# EAGLE schematic LEDSubMatrixHighDensity (EAGLE 9.6.2)
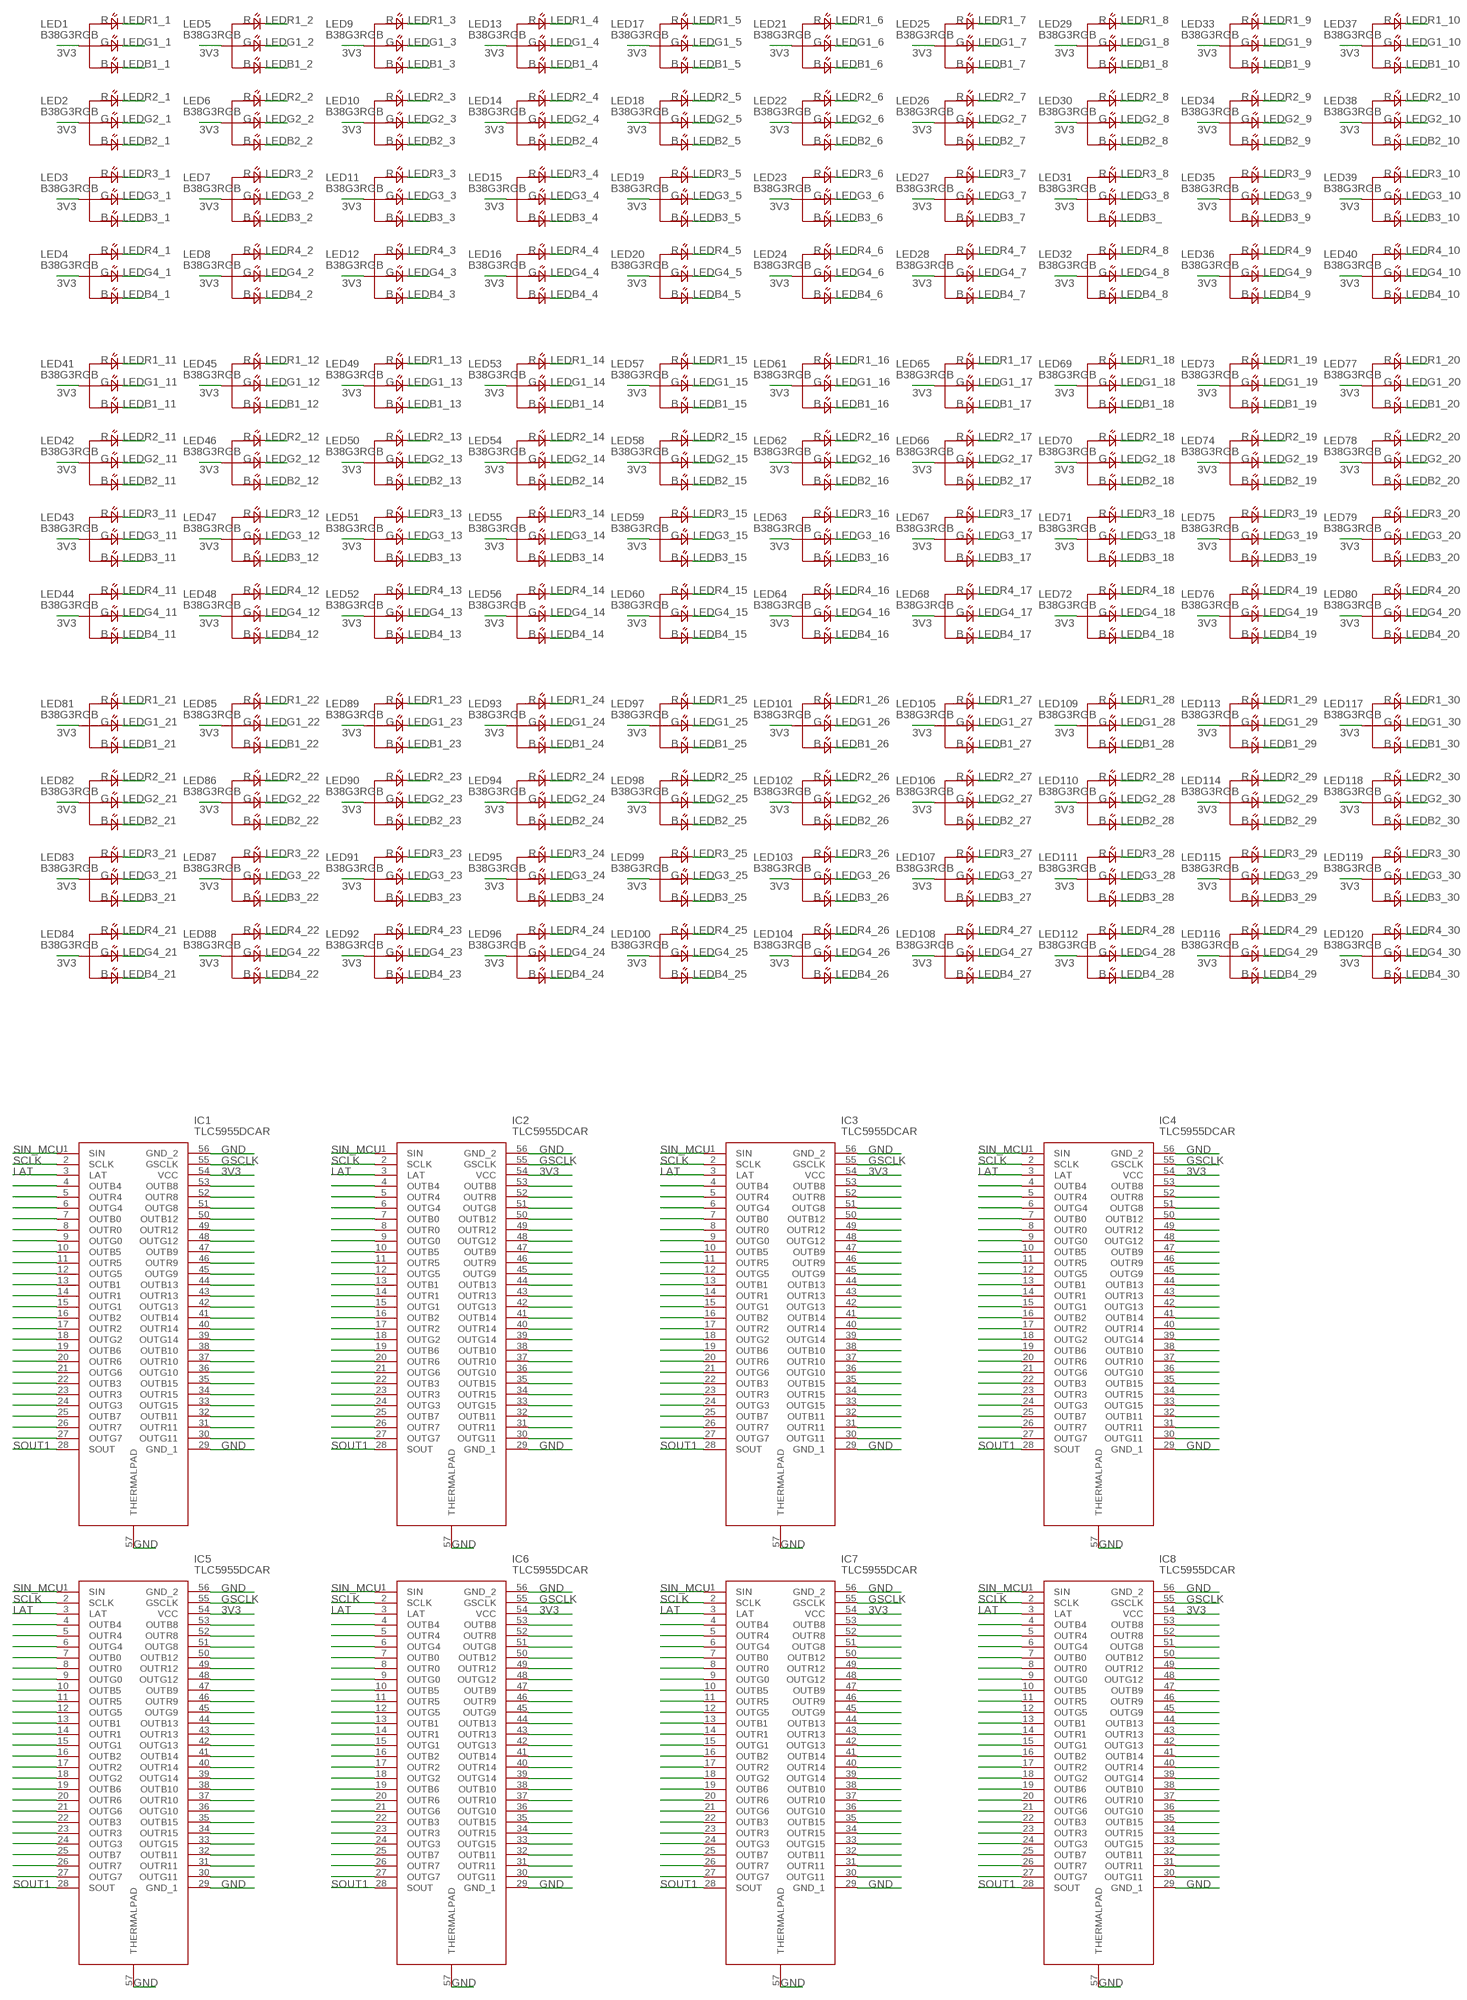
[diagram p0: schematic, sheet 1]

## Parts
IC1  TLC5955DCAR  [SOP50P810X120-57N]
IC2  TLC5955DCAR  [SOP50P810X120-57N]
IC3  TLC5955DCAR  [SOP50P810X120-57N]
IC4  TLC5955DCAR  [SOP50P810X120-57N]
IC5  TLC5955DCAR  [SOP50P810X120-57N]
IC6  TLC5955DCAR  [SOP50P810X120-57N]
IC7  TLC5955DCAR  [SOP50P810X120-57N]
IC8  TLC5955DCAR  [SOP50P810X120-57N]
LED1  B38G3RGB  [B38G3RGB]
LED2  B38G3RGB  [B38G3RGB]
LED3  B38G3RGB  [B38G3RGB]
LED4  B38G3RGB  [B38G3RGB]
LED5  B38G3RGB  [B38G3RGB]
LED6  B38G3RGB  [B38G3RGB]
LED7  B38G3RGB  [B38G3RGB]
LED8  B38G3RGB  [B38G3RGB]
LED9  B38G3RGB  [B38G3RGB]
LED10  B38G3RGB  [B38G3RGB]
LED11  B38G3RGB  [B38G3RGB]
LED12  B38G3RGB  [B38G3RGB]
LED13  B38G3RGB  [B38G3RGB]
LED14  B38G3RGB  [B38G3RGB]
LED15  B38G3RGB  [B38G3RGB]
LED16  B38G3RGB  [B38G3RGB]
LED17  B38G3RGB  [B38G3RGB]
LED18  B38G3RGB  [B38G3RGB]
LED19  B38G3RGB  [B38G3RGB]
LED20  B38G3RGB  [B38G3RGB]
LED21  B38G3RGB  [B38G3RGB]
LED22  B38G3RGB  [B38G3RGB]
LED23  B38G3RGB  [B38G3RGB]
LED24  B38G3RGB  [B38G3RGB]
LED25  B38G3RGB  [B38G3RGB]
LED26  B38G3RGB  [B38G3RGB]
LED27  B38G3RGB  [B38G3RGB]
LED28  B38G3RGB  [B38G3RGB]
LED29  B38G3RGB  [B38G3RGB]
LED30  B38G3RGB  [B38G3RGB]
LED31  B38G3RGB  [B38G3RGB]
LED32  B38G3RGB  [B38G3RGB]
LED33  B38G3RGB  [B38G3RGB]
LED34  B38G3RGB  [B38G3RGB]
LED35  B38G3RGB  [B38G3RGB]
LED36  B38G3RGB  [B38G3RGB]
LED37  B38G3RGB  [B38G3RGB]
LED38  B38G3RGB  [B38G3RGB]
LED39  B38G3RGB  [B38G3RGB]
LED40  B38G3RGB  [B38G3RGB]
LED41  B38G3RGB  [B38G3RGB]
LED42  B38G3RGB  [B38G3RGB]
LED43  B38G3RGB  [B38G3RGB]
LED44  B38G3RGB  [B38G3RGB]
LED45  B38G3RGB  [B38G3RGB]
LED46  B38G3RGB  [B38G3RGB]
LED47  B38G3RGB  [B38G3RGB]
LED48  B38G3RGB  [B38G3RGB]
LED49  B38G3RGB  [B38G3RGB]
LED50  B38G3RGB  [B38G3RGB]
LED51  B38G3RGB  [B38G3RGB]
LED52  B38G3RGB  [B38G3RGB]
LED53  B38G3RGB  [B38G3RGB]
LED54  B38G3RGB  [B38G3RGB]
LED55  B38G3RGB  [B38G3RGB]
LED56  B38G3RGB  [B38G3RGB]
LED57  B38G3RGB  [B38G3RGB]
LED58  B38G3RGB  [B38G3RGB]
LED59  B38G3RGB  [B38G3RGB]
LED60  B38G3RGB  [B38G3RGB]
LED61  B38G3RGB  [B38G3RGB]
LED62  B38G3RGB  [B38G3RGB]
LED63  B38G3RGB  [B38G3RGB]
LED64  B38G3RGB  [B38G3RGB]
LED65  B38G3RGB  [B38G3RGB]
LED66  B38G3RGB  [B38G3RGB]
LED67  B38G3RGB  [B38G3RGB]
LED68  B38G3RGB  [B38G3RGB]
LED69  B38G3RGB  [B38G3RGB]
LED70  B38G3RGB  [B38G3RGB]
LED71  B38G3RGB  [B38G3RGB]
LED72  B38G3RGB  [B38G3RGB]
LED73  B38G3RGB  [B38G3RGB]
LED74  B38G3RGB  [B38G3RGB]
LED75  B38G3RGB  [B38G3RGB]
LED76  B38G3RGB  [B38G3RGB]
LED77  B38G3RGB  [B38G3RGB]
LED78  B38G3RGB  [B38G3RGB]
LED79  B38G3RGB  [B38G3RGB]
LED80  B38G3RGB  [B38G3RGB]
LED81  B38G3RGB  [B38G3RGB]
LED82  B38G3RGB  [B38G3RGB]
LED83  B38G3RGB  [B38G3RGB]
LED84  B38G3RGB  [B38G3RGB]
LED85  B38G3RGB  [B38G3RGB]
LED86  B38G3RGB  [B38G3RGB]
LED87  B38G3RGB  [B38G3RGB]
LED88  B38G3RGB  [B38G3RGB]
LED89  B38G3RGB  [B38G3RGB]
LED90  B38G3RGB  [B38G3RGB]
LED91  B38G3RGB  [B38G3RGB]
LED92  B38G3RGB  [B38G3RGB]
LED93  B38G3RGB  [B38G3RGB]
LED94  B38G3RGB  [B38G3RGB]
LED95  B38G3RGB  [B38G3RGB]
LED96  B38G3RGB  [B38G3RGB]
LED97  B38G3RGB  [B38G3RGB]
LED98  B38G3RGB  [B38G3RGB]
LED99  B38G3RGB  [B38G3RGB]
LED100  B38G3RGB  [B38G3RGB]
LED101  B38G3RGB  [B38G3RGB]
LED102  B38G3RGB  [B38G3RGB]
LED103  B38G3RGB  [B38G3RGB]
LED104  B38G3RGB  [B38G3RGB]
LED105  B38G3RGB  [B38G3RGB]
LED106  B38G3RGB  [B38G3RGB]
LED107  B38G3RGB  [B38G3RGB]
LED108  B38G3RGB  [B38G3RGB]
LED109  B38G3RGB  [B38G3RGB]
LED110  B38G3RGB  [B38G3RGB]
LED111  B38G3RGB  [B38G3RGB]
LED112  B38G3RGB  [B38G3RGB]
LED113  B38G3RGB  [B38G3RGB]
LED114  B38G3RGB  [B38G3RGB]
LED115  B38G3RGB  [B38G3RGB]
LED116  B38G3RGB  [B38G3RGB]
LED117  B38G3RGB  [B38G3RGB]
LED118  B38G3RGB  [B38G3RGB]
LED119  B38G3RGB  [B38G3RGB]
LED120  B38G3RGB  [B38G3RGB]

## Nets
3V3: IC1.54(VCC) IC2.54(VCC) IC3.54(VCC) IC4.54(VCC) IC5.54(VCC) IC6.54(VCC) IC7.54(VCC) IC8.54(VCC) LED1.3(COM) LED2.3(COM) LED3.3(COM) LED4.3(COM) LED5.3(COM) LED6.3(COM) LED7.3(COM) LED8.3(COM) LED9.3(COM) LED10.3(COM) LED11.3(COM) LED12.3(COM) LED13.3(COM) LED14.3(COM) LED15.3(COM) LED16.3(COM) LED17.3(COM) LED18.3(COM) LED19.3(COM) LED20.3(COM) LED21.3(COM) LED22.3(COM) LED23.3(COM) LED24.3(COM) LED25.3(COM) LED26.3(COM) LED27.3(COM) LED28.3(COM) LED29.3(COM) LED30.3(COM) LED31.3(COM) LED32.3(COM) LED33.3(COM) LED34.3(COM) LED35.3(COM) LED36.3(COM) LED37.3(COM) LED38.3(COM) LED39.3(COM) LED40.3(COM) LED41.3(COM) LED42.3(COM) LED43.3(COM) LED44.3(COM) LED45.3(COM) LED46.3(COM) LED47.3(COM) LED48.3(COM) LED49.3(COM) LED50.3(COM) LED51.3(COM) LED52.3(COM) LED53.3(COM) LED54.3(COM) LED55.3(COM) LED56.3(COM) LED57.3(COM) LED58.3(COM) LED59.3(COM) LED60.3(COM) LED61.3(COM) LED62.3(COM) LED63.3(COM) LED64.3(COM) LED65.3(COM) LED66.3(COM) LED67.3(COM) LED68.3(COM) LED69.3(COM) LED70.3(COM) LED71.3(COM) LED72.3(COM) LED73.3(COM) LED74.3(COM) LED75.3(COM) LED76.3(COM) LED77.3(COM) LED78.3(COM) LED79.3(COM) LED80.3(COM) LED81.3(COM) LED82.3(COM) LED83.3(COM) LED84.3(COM) LED85.3(COM) LED86.3(COM) LED87.3(COM) LED88.3(COM) LED89.3(COM) LED90.3(COM) LED91.3(COM) LED92.3(COM) LED93.3(COM) LED94.3(COM) LED95.3(COM) LED96.3(COM) LED97.3(COM) LED98.3(COM) LED99.3(COM) LED100.3(COM) LED101.3(COM) LED102.3(COM) LED103.3(COM) LED104.3(COM) LED105.3(COM) LED106.3(COM) LED107.3(COM) LED108.3(COM) LED109.3(COM) LED110.3(COM) LED111.3(COM) LED112.3(COM) LED113.3(COM) LED114.3(COM) LED115.3(COM) LED116.3(COM) LED117.3(COM) LED118.3(COM) LED119.3(COM) LED120.3(COM)
GND: IC1.29(GND_1) IC1.56(GND_2) IC1.57(THERMALPAD) IC2.29(GND_1) IC2.56(GND_2) IC2.57(THERMALPAD) IC3.29(GND_1) IC3.56(GND_2) IC3.57(THERMALPAD) IC4.29(GND_1) IC4.56(GND_2) IC4.57(THERMALPAD) IC5.29(GND_1) IC5.56(GND_2) IC5.57(THERMALPAD) IC6.29(GND_1) IC6.56(GND_2) IC6.57(THERMALPAD) IC7.29(GND_1) IC7.56(GND_2) IC7.57(THERMALPAD) IC8.29(GND_1) IC8.56(GND_2) IC8.57(THERMALPAD)
GSCLK: IC1.55(GSCLK) IC2.55(GSCLK) IC3.55(GSCLK) IC4.55(GSCLK) IC5.55(GSCLK) IC6.55(GSCLK) IC7.55(GSCLK) IC8.55(GSCLK)
LAT: IC1.3(LAT) IC2.3(LAT) IC3.3(LAT) IC4.3(LAT) IC5.3(LAT) IC6.3(LAT) IC7.3(LAT) IC8.3(LAT)
LEDB1_1: LED1.2(BLUE)
LEDB1_2: LED5.2(BLUE)
LEDB1_3: LED9.2(BLUE)
LEDB1_4: LED13.2(BLUE)
LEDB1_5: LED17.2(BLUE)
LEDB1_6: LED21.2(BLUE)
LEDB1_7: LED25.2(BLUE)
LEDB1_8: LED29.2(BLUE)
LEDB1_9: LED33.2(BLUE)
LEDB1_10: LED37.2(BLUE)
LEDB1_11: LED41.2(BLUE)
LEDB1_12: LED45.2(BLUE)
LEDB1_13: LED49.2(BLUE)
LEDB1_14: LED53.2(BLUE)
LEDB1_15: LED57.2(BLUE)
LEDB1_16: LED61.2(BLUE)
LEDB1_17: LED65.2(BLUE)
LEDB1_18: LED69.2(BLUE)
LEDB1_19: LED73.2(BLUE)
LEDB1_20: LED77.2(BLUE)
LEDB1_21: LED81.2(BLUE)
LEDB1_22: LED85.2(BLUE)
LEDB1_23: LED89.2(BLUE)
LEDB1_24: LED93.2(BLUE)
LEDB1_25: LED97.2(BLUE)
LEDB1_26: LED101.2(BLUE)
LEDB1_27: LED105.2(BLUE)
LEDB1_28: LED109.2(BLUE)
LEDB1_29: LED113.2(BLUE)
LEDB1_30: LED117.2(BLUE)
LEDB2_1: LED2.2(BLUE)
LEDB2_2: LED6.2(BLUE)
LEDB2_3: LED10.2(BLUE)
LEDB2_4: LED14.2(BLUE)
LEDB2_5: LED18.2(BLUE)
LEDB2_6: LED22.2(BLUE)
LEDB2_7: LED26.2(BLUE)
LEDB2_8: LED30.2(BLUE)
LEDB2_9: LED34.2(BLUE)
LEDB2_10: LED38.2(BLUE)
LEDB2_11: LED42.2(BLUE)
LEDB2_12: LED46.2(BLUE)
LEDB2_13: LED50.2(BLUE)
LEDB2_14: LED54.2(BLUE)
LEDB2_15: LED58.2(BLUE)
LEDB2_16: LED62.2(BLUE)
LEDB2_17: LED66.2(BLUE)
LEDB2_18: LED70.2(BLUE)
LEDB2_19: LED74.2(BLUE)
LEDB2_20: LED78.2(BLUE)
LEDB2_21: LED82.2(BLUE)
LEDB2_22: LED86.2(BLUE)
LEDB2_23: LED90.2(BLUE)
LEDB2_24: LED94.2(BLUE)
LEDB2_25: LED98.2(BLUE)
LEDB2_26: LED102.2(BLUE)
LEDB2_27: LED106.2(BLUE)
LEDB2_28: LED110.2(BLUE)
LEDB2_29: LED114.2(BLUE)
LEDB2_30: LED118.2(BLUE)
LEDB3_: LED31.2(BLUE)
LEDB3_1: LED3.2(BLUE)
LEDB3_2: LED7.2(BLUE)
LEDB3_3: LED11.2(BLUE)
LEDB3_4: LED15.2(BLUE)
LEDB3_5: LED19.2(BLUE)
LEDB3_6: LED23.2(BLUE)
LEDB3_7: LED27.2(BLUE)
LEDB3_9: LED35.2(BLUE)
LEDB3_10: LED39.2(BLUE)
LEDB3_11: LED43.2(BLUE)
LEDB3_12: LED47.2(BLUE)
LEDB3_13: LED51.2(BLUE)
LEDB3_14: LED55.2(BLUE)
LEDB3_15: LED59.2(BLUE)
LEDB3_16: LED63.2(BLUE)
LEDB3_17: LED67.2(BLUE)
LEDB3_18: LED71.2(BLUE)
LEDB3_19: LED75.2(BLUE)
LEDB3_20: LED79.2(BLUE)
LEDB3_21: LED83.2(BLUE)
LEDB3_22: LED87.2(BLUE)
LEDB3_23: LED91.2(BLUE)
LEDB3_24: LED95.2(BLUE)
LEDB3_25: LED99.2(BLUE)
LEDB3_26: LED103.2(BLUE)
LEDB3_27: LED107.2(BLUE)
LEDB3_28: LED111.2(BLUE)
LEDB3_29: LED115.2(BLUE)
LEDB3_30: LED119.2(BLUE)
LEDB4_1: LED4.2(BLUE)
LEDB4_2: LED8.2(BLUE)
LEDB4_3: LED12.2(BLUE)
LEDB4_4: LED16.2(BLUE)
LEDB4_5: LED20.2(BLUE)
LEDB4_6: LED24.2(BLUE)
LEDB4_7: LED28.2(BLUE)
LEDB4_8: LED32.2(BLUE)
LEDB4_9: LED36.2(BLUE)
LEDB4_10: LED40.2(BLUE)
LEDB4_11: LED44.2(BLUE)
LEDB4_12: LED48.2(BLUE)
LEDB4_13: LED52.2(BLUE)
LEDB4_14: LED56.2(BLUE)
LEDB4_15: LED60.2(BLUE)
LEDB4_16: LED64.2(BLUE)
LEDB4_17: LED68.2(BLUE)
LEDB4_18: LED72.2(BLUE)
LEDB4_19: LED76.2(BLUE)
LEDB4_20: LED80.2(BLUE)
LEDB4_21: LED84.2(BLUE)
LEDB4_22: LED88.2(BLUE)
LEDB4_23: LED92.2(BLUE)
LEDB4_24: LED96.2(BLUE)
LEDB4_25: LED100.2(BLUE)
LEDB4_26: LED104.2(BLUE)
LEDB4_27: LED108.2(BLUE)
LEDB4_28: LED112.2(BLUE)
LEDB4_29: LED116.2(BLUE)
LEDB4_30: LED120.2(BLUE)
LEDG1_1: LED1.1(GREEN)
LEDG1_2: LED5.1(GREEN)
LEDG1_3: LED9.1(GREEN)
LEDG1_4: LED13.1(GREEN)
LEDG1_5: LED17.1(GREEN)
LEDG1_6: LED21.1(GREEN)
LEDG1_7: LED25.1(GREEN)
LEDG1_8: LED29.1(GREEN)
LEDG1_9: LED33.1(GREEN)
LEDG1_10: LED37.1(GREEN)
LEDG1_11: LED41.1(GREEN)
LEDG1_12: LED45.1(GREEN)
LEDG1_13: LED49.1(GREEN)
LEDG1_14: LED53.1(GREEN)
LEDG1_15: LED57.1(GREEN)
LEDG1_16: LED61.1(GREEN)
LEDG1_17: LED65.1(GREEN)
LEDG1_18: LED69.1(GREEN)
LEDG1_19: LED73.1(GREEN)
LEDG1_20: LED77.1(GREEN)
LEDG1_21: LED81.1(GREEN)
LEDG1_22: LED85.1(GREEN)
LEDG1_23: LED89.1(GREEN)
LEDG1_24: LED93.1(GREEN)
LEDG1_25: LED97.1(GREEN)
LEDG1_26: LED101.1(GREEN)
LEDG1_27: LED105.1(GREEN)
LEDG1_28: LED109.1(GREEN)
LEDG1_29: LED113.1(GREEN)
LEDG1_30: LED117.1(GREEN)
LEDG2_1: LED2.1(GREEN)
LEDG2_2: LED6.1(GREEN)
LEDG2_3: LED10.1(GREEN)
LEDG2_4: LED14.1(GREEN)
LEDG2_5: LED18.1(GREEN)
LEDG2_6: LED22.1(GREEN)
LEDG2_7: LED26.1(GREEN)
LEDG2_8: LED30.1(GREEN)
LEDG2_9: LED34.1(GREEN)
LEDG2_10: LED38.1(GREEN)
LEDG2_11: LED42.1(GREEN)
LEDG2_12: LED46.1(GREEN)
LEDG2_13: LED50.1(GREEN)
LEDG2_14: LED54.1(GREEN)
LEDG2_15: LED58.1(GREEN)
LEDG2_16: LED62.1(GREEN)
LEDG2_17: LED66.1(GREEN)
LEDG2_18: LED70.1(GREEN)
LEDG2_19: LED74.1(GREEN)
LEDG2_20: LED78.1(GREEN)
LEDG2_21: LED82.1(GREEN)
LEDG2_22: LED86.1(GREEN)
LEDG2_23: LED90.1(GREEN)
LEDG2_24: LED94.1(GREEN)
LEDG2_25: LED98.1(GREEN)
LEDG2_26: LED102.1(GREEN)
LEDG2_27: LED106.1(GREEN)
LEDG2_28: LED110.1(GREEN)
LEDG2_29: LED114.1(GREEN)
LEDG2_30: LED118.1(GREEN)
LEDG3_1: LED3.1(GREEN)
LEDG3_2: LED7.1(GREEN)
LEDG3_3: LED11.1(GREEN)
LEDG3_4: LED15.1(GREEN)
LEDG3_5: LED19.1(GREEN)
LEDG3_6: LED23.1(GREEN)
LEDG3_7: LED27.1(GREEN)
LEDG3_8: LED31.1(GREEN)
LEDG3_9: LED35.1(GREEN)
LEDG3_10: LED39.1(GREEN)
LEDG3_11: LED43.1(GREEN)
LEDG3_12: LED47.1(GREEN)
LEDG3_13: LED51.1(GREEN)
LEDG3_14: LED55.1(GREEN)
LEDG3_15: LED59.1(GREEN)
LEDG3_16: LED63.1(GREEN)
LEDG3_17: LED67.1(GREEN)
LEDG3_18: LED71.1(GREEN)
LEDG3_19: LED75.1(GREEN)
LEDG3_20: LED79.1(GREEN)
LEDG3_21: LED83.1(GREEN)
LEDG3_22: LED87.1(GREEN)
LEDG3_23: LED91.1(GREEN)
LEDG3_24: LED95.1(GREEN)
LEDG3_25: LED99.1(GREEN)
LEDG3_26: LED103.1(GREEN)
LEDG3_27: LED107.1(GREEN)
LEDG3_28: LED111.1(GREEN)
LEDG3_29: LED115.1(GREEN)
LEDG3_30: LED119.1(GREEN)
LEDG4_1: LED4.1(GREEN)
LEDG4_2: LED8.1(GREEN)
LEDG4_3: LED12.1(GREEN)
LEDG4_4: LED16.1(GREEN)
LEDG4_5: LED20.1(GREEN)
LEDG4_6: LED24.1(GREEN)
LEDG4_7: LED28.1(GREEN)
LEDG4_8: LED32.1(GREEN)
LEDG4_9: LED36.1(GREEN)
LEDG4_10: LED40.1(GREEN)
LEDG4_11: LED44.1(GREEN)
LEDG4_12: LED48.1(GREEN)
LEDG4_13: LED52.1(GREEN)
LEDG4_14: LED56.1(GREEN)
LEDG4_15: LED60.1(GREEN)
LEDG4_16: LED64.1(GREEN)
LEDG4_17: LED68.1(GREEN)
LEDG4_18: LED72.1(GREEN)
LEDG4_19: LED76.1(GREEN)
LEDG4_20: LED80.1(GREEN)
LEDG4_21: LED84.1(GREEN)
LEDG4_22: LED88.1(GREEN)
LEDG4_23: LED92.1(GREEN)
LEDG4_24: LED96.1(GREEN)
LEDG4_25: LED100.1(GREEN)
LEDG4_26: LED104.1(GREEN)
LEDG4_27: LED108.1(GREEN)
LEDG4_28: LED112.1(GREEN)
LEDG4_29: LED116.1(GREEN)
LEDG4_30: LED120.1(GREEN)
LEDR1_1: LED1.4(RED)
LEDR1_2: LED5.4(RED)
LEDR1_3: LED9.4(RED)
LEDR1_4: LED13.4(RED)
LEDR1_5: LED17.4(RED)
LEDR1_6: LED21.4(RED)
LEDR1_7: LED25.4(RED)
LEDR1_8: LED29.4(RED)
LEDR1_9: LED33.4(RED)
LEDR1_10: LED37.4(RED)
LEDR1_11: LED41.4(RED)
LEDR1_12: LED45.4(RED)
LEDR1_13: LED49.4(RED)
LEDR1_14: LED53.4(RED)
LEDR1_15: LED57.4(RED)
LEDR1_16: LED61.4(RED)
LEDR1_17: LED65.4(RED)
LEDR1_18: LED69.4(RED)
LEDR1_19: LED73.4(RED)
LEDR1_20: LED77.4(RED)
LEDR1_21: LED81.4(RED)
LEDR1_22: LED85.4(RED)
LEDR1_23: LED89.4(RED)
LEDR1_24: LED93.4(RED)
LEDR1_25: LED97.4(RED)
LEDR1_26: LED101.4(RED)
LEDR1_27: LED105.4(RED)
LEDR1_28: LED109.4(RED)
LEDR1_29: LED113.4(RED)
LEDR1_30: LED117.4(RED)
LEDR2_1: LED2.4(RED)
LEDR2_2: LED6.4(RED)
LEDR2_3: LED10.4(RED)
LEDR2_4: LED14.4(RED)
LEDR2_5: LED18.4(RED)
LEDR2_6: LED22.4(RED)
LEDR2_7: LED26.4(RED)
LEDR2_8: LED30.4(RED)
LEDR2_9: LED34.4(RED)
LEDR2_10: LED38.4(RED)
LEDR2_11: LED42.4(RED)
LEDR2_12: LED46.4(RED)
LEDR2_13: LED50.4(RED)
LEDR2_14: LED54.4(RED)
LEDR2_15: LED58.4(RED)
LEDR2_16: LED62.4(RED)
LEDR2_17: LED66.4(RED)
LEDR2_18: LED70.4(RED)
LEDR2_19: LED74.4(RED)
LEDR2_20: LED78.4(RED)
LEDR2_21: LED82.4(RED)
LEDR2_22: LED86.4(RED)
LEDR2_23: LED90.4(RED)
LEDR2_24: LED94.4(RED)
LEDR2_25: LED98.4(RED)
LEDR2_26: LED102.4(RED)
LEDR2_27: LED106.4(RED)
LEDR2_28: LED110.4(RED)
LEDR2_29: LED114.4(RED)
LEDR2_30: LED118.4(RED)
LEDR3_1: LED3.4(RED)
LEDR3_2: LED7.4(RED)
LEDR3_3: LED11.4(RED)
LEDR3_4: LED15.4(RED)
LEDR3_5: LED19.4(RED)
LEDR3_6: LED23.4(RED)
LEDR3_7: LED27.4(RED)
LEDR3_8: LED31.4(RED)
LEDR3_9: LED35.4(RED)
LEDR3_10: LED39.4(RED)
LEDR3_11: LED43.4(RED)
LEDR3_12: LED47.4(RED)
LEDR3_13: LED51.4(RED)
LEDR3_14: LED55.4(RED)
LEDR3_15: LED59.4(RED)
LEDR3_16: LED63.4(RED)
LEDR3_17: LED67.4(RED)
LEDR3_18: LED71.4(RED)
LEDR3_19: LED75.4(RED)
LEDR3_20: LED79.4(RED)
LEDR3_21: LED83.4(RED)
LEDR3_22: LED87.4(RED)
LEDR3_23: LED91.4(RED)
LEDR3_24: LED95.4(RED)
LEDR3_25: LED99.4(RED)
LEDR3_26: LED103.4(RED)
LEDR3_27: LED107.4(RED)
LEDR3_28: LED111.4(RED)
LEDR3_29: LED115.4(RED)
LEDR3_30: LED119.4(RED)
LEDR4_1: LED4.4(RED)
LEDR4_2: LED8.4(RED)
LEDR4_3: LED12.4(RED)
LEDR4_4: LED16.4(RED)
LEDR4_5: LED20.4(RED)
LEDR4_6: LED24.4(RED)
LEDR4_7: LED28.4(RED)
LEDR4_8: LED32.4(RED)
LEDR4_9: LED36.4(RED)
LEDR4_10: LED40.4(RED)
LEDR4_11: LED44.4(RED)
LEDR4_12: LED48.4(RED)
LEDR4_13: LED52.4(RED)
LEDR4_14: LED56.4(RED)
LEDR4_15: LED60.4(RED)
LEDR4_16: LED64.4(RED)
LEDR4_17: LED68.4(RED)
LEDR4_18: LED72.4(RED)
LEDR4_19: LED76.4(RED)
LEDR4_20: LED80.4(RED)
LEDR4_21: LED84.4(RED)
LEDR4_22: LED88.4(RED)
LEDR4_23: LED92.4(RED)
LEDR4_24: LED96.4(RED)
LEDR4_25: LED100.4(RED)
LEDR4_26: LED104.4(RED)
LEDR4_27: LED108.4(RED)
LEDR4_28: LED112.4(RED)
LEDR4_29: LED116.4(RED)
LEDR4_30: LED120.4(RED)
N$1: IC2.4(OUTB4)
N$2: IC2.5(OUTR4)
N$3: IC2.6(OUTG4)
N$4: IC1.4(OUTB4)
N$5: IC1.5(OUTR4)
N$6: IC1.6(OUTG4)
N$7: IC1.7(OUTB0)
N$8: IC1.8(OUTR0)
N$9: IC1.9(OUTG0)
N$10: IC1.10(OUTB5)
N$11: IC1.11(OUTR5)
N$12: IC1.12(OUTG5)
N$13: IC1.13(OUTB1)
N$14: IC1.14(OUTR1)
N$15: IC1.15(OUTG1)
N$16: IC1.16(OUTB2)
N$17: IC1.17(OUTR2)
N$18: IC1.18(OUTG2)
N$19: IC2.7(OUTB0)
N$20: IC1.53(OUTB8)
N$21: IC1.52(OUTR8)
N$22: IC1.51(OUTG8)
N$23: IC1.50(OUTB12)
N$24: IC1.49(OUTR12)
N$25: IC1.48(OUTG12)
N$26: IC1.47(OUTB9)
N$27: IC1.46(OUTR9)
N$28: IC1.45(OUTG9)
N$29: IC1.44(OUTB13)
N$30: IC1.43(OUTR13)
N$31: IC1.42(OUTG13)
N$32: IC1.41(OUTB14)
N$33: IC1.40(OUTR14)
N$34: IC1.39(OUTG14)
N$35: IC1.38(OUTB10)
N$36: IC1.37(OUTR10)
N$37: IC1.36(OUTG10)
N$38: IC1.35(OUTB15)
N$39: IC1.34(OUTR15)
N$40: IC1.33(OUTG15)
N$41: IC1.32(OUTB11)
N$42: IC1.31(OUTR11)
N$43: IC1.30(OUTG11)
N$44: IC2.8(OUTR0)
N$45: IC1.19(OUTB6)
N$46: IC1.20(OUTR6)
N$47: IC2.9(OUTG0)
N$48: IC1.21(OUTG6)
N$49: IC1.22(OUTB3)
N$50: IC1.23(OUTR3)
N$51: IC1.24(OUTG3)
N$52: IC1.25(OUTB7)
N$53: IC1.26(OUTR7)
N$54: IC1.27(OUTG7)
N$55: IC2.10(OUTB5)
N$56: IC2.11(OUTR5)
N$57: IC2.12(OUTG5)
N$58: IC2.13(OUTB1)
N$59: IC2.14(OUTR1)
N$60: IC2.15(OUTG1)
N$61: IC2.16(OUTB2)
N$62: IC2.17(OUTR2)
N$63: IC2.18(OUTG2)
N$64: IC2.53(OUTB8)
N$65: IC2.52(OUTR8)
N$66: IC2.51(OUTG8)
N$67: IC2.50(OUTB12)
N$68: IC2.49(OUTR12)
N$69: IC2.48(OUTG12)
N$70: IC2.47(OUTB9)
N$71: IC2.46(OUTR9)
N$72: IC2.45(OUTG9)
N$73: IC2.44(OUTB13)
N$74: IC2.43(OUTR13)
N$75: IC2.42(OUTG13)
N$76: IC2.41(OUTB14)
N$77: IC2.40(OUTR14)
N$78: IC2.39(OUTG14)
N$79: IC2.38(OUTB10)
N$80: IC2.37(OUTR10)
N$81: IC2.36(OUTG10)
N$82: IC2.35(OUTB15)
N$83: IC2.34(OUTR15)
N$84: IC2.33(OUTG15)
N$85: IC2.32(OUTB11)
N$86: IC2.31(OUTR11)
N$87: IC2.30(OUTG11)
N$88: IC2.19(OUTB6)
N$89: IC2.20(OUTR6)
N$90: IC2.21(OUTG6)
N$91: IC2.22(OUTB3)
N$92: IC2.23(OUTR3)
N$93: IC2.24(OUTG3)
N$94: IC2.25(OUTB7)
N$95: IC2.26(OUTR7)
N$96: IC2.27(OUTG7)
N$97: IC3.4(OUTB4)
N$98: IC3.5(OUTR4)
N$99: IC3.6(OUTG4)
N$100: IC3.7(OUTB0)
N$101: IC3.8(OUTR0)
N$102: IC3.9(OUTG0)
N$103: IC3.10(OUTB5)
N$104: IC3.11(OUTR5)
N$105: IC3.12(OUTG5)
N$106: IC3.13(OUTB1)
N$107: IC3.14(OUTR1)
N$108: IC3.15(OUTG1)
N$109: IC3.16(OUTB2)
N$110: IC3.17(OUTR2)
N$111: IC3.18(OUTG2)
N$112: IC3.53(OUTB8)
N$113: IC3.52(OUTR8)
N$114: IC3.51(OUTG8)
N$115: IC3.50(OUTB12)
N$116: IC3.49(OUTR12)
N$117: IC3.48(OUTG12)
N$118: IC3.47(OUTB9)
N$119: IC3.46(OUTR9)
N$120: IC3.45(OUTG9)
N$121: IC3.44(OUTB13)
N$122: IC3.43(OUTR13)
N$123: IC3.42(OUTG13)
N$124: IC3.41(OUTB14)
N$125: IC3.40(OUTR14)
N$126: IC3.39(OUTG14)
N$127: IC3.38(OUTB10)
N$128: IC3.37(OUTR10)
N$129: IC3.36(OUTG10)
N$130: IC3.35(OUTB15)
N$131: IC3.34(OUTR15)
N$132: IC3.33(OUTG15)
N$133: IC3.32(OUTB11)
N$134: IC3.31(OUTR11)
N$135: IC3.30(OUTG11)
N$136: IC3.19(OUTB6)
N$137: IC3.20(OUTR6)
N$138: IC3.21(OUTG6)
N$139: IC3.22(OUTB3)
N$140: IC3.23(OUTR3)
N$141: IC3.24(OUTG3)
N$142: IC3.25(OUTB7)
N$143: IC3.26(OUTR7)
N$144: IC3.27(OUTG7)
N$145: IC4.4(OUTB4)
N$146: IC4.5(OUTR4)
N$147: IC4.6(OUTG4)
N$148: IC4.7(OUTB0)
N$149: IC4.8(OUTR0)
N$150: IC4.9(OUTG0)
N$151: IC4.10(OUTB5)
N$152: IC4.11(OUTR5)
N$153: IC4.12(OUTG5)
N$154: IC4.13(OUTB1)
N$155: IC4.14(OUTR1)
N$156: IC4.15(OUTG1)
N$157: IC4.16(OUTB2)
N$158: IC4.17(OUTR2)
N$159: IC4.18(OUTG2)
N$160: IC4.53(OUTB8)
N$161: IC4.52(OUTR8)
N$162: IC4.51(OUTG8)
N$163: IC4.50(OUTB12)
N$164: IC4.49(OUTR12)
N$165: IC4.48(OUTG12)
N$166: IC4.47(OUTB9)
N$167: IC4.46(OUTR9)
N$168: IC4.45(OUTG9)
N$169: IC4.44(OUTB13)
N$170: IC4.43(OUTR13)
N$171: IC4.42(OUTG13)
N$172: IC4.41(OUTB14)
N$173: IC4.40(OUTR14)
N$174: IC4.39(OUTG14)
N$175: IC4.38(OUTB10)
N$176: IC4.37(OUTR10)
N$177: IC4.36(OUTG10)
N$178: IC4.35(OUTB15)
N$179: IC4.34(OUTR15)
N$180: IC4.33(OUTG15)
N$181: IC4.32(OUTB11)
N$182: IC4.31(OUTR11)
N$183: IC4.30(OUTG11)
N$184: IC4.19(OUTB6)
N$185: IC4.20(OUTR6)
N$186: IC4.21(OUTG6)
N$187: IC4.22(OUTB3)
N$188: IC4.23(OUTR3)
N$189: IC4.24(OUTG3)
N$190: IC4.25(OUTB7)
N$191: IC4.26(OUTR7)
N$192: IC4.27(OUTG7)
N$193: IC5.4(OUTB4)
N$194: IC5.5(OUTR4)
N$195: IC5.6(OUTG4)
N$196: IC5.7(OUTB0)
N$197: IC5.8(OUTR0)
N$198: IC5.9(OUTG0)
N$199: IC5.10(OUTB5)
N$200: IC5.11(OUTR5)
N$201: IC5.12(OUTG5)
N$202: IC5.13(OUTB1)
N$203: IC5.14(OUTR1)
N$204: IC5.15(OUTG1)
N$205: IC5.16(OUTB2)
N$206: IC5.17(OUTR2)
N$207: IC5.18(OUTG2)
N$208: IC5.53(OUTB8)
N$209: IC5.52(OUTR8)
N$210: IC5.51(OUTG8)
N$211: IC5.50(OUTB12)
N$212: IC5.49(OUTR12)
N$213: IC5.48(OUTG12)
N$214: IC5.47(OUTB9)
N$215: IC5.46(OUTR9)
N$216: IC5.45(OUTG9)
N$217: IC5.44(OUTB13)
N$218: IC5.43(OUTR13)
N$219: IC5.42(OUTG13)
N$220: IC5.41(OUTB14)
N$221: IC5.40(OUTR14)
N$222: IC5.39(OUTG14)
N$223: IC5.38(OUTB10)
N$224: IC5.37(OUTR10)
N$225: IC5.36(OUTG10)
N$226: IC5.35(OUTB15)
N$227: IC5.34(OUTR15)
N$228: IC5.33(OUTG15)
N$229: IC5.32(OUTB11)
N$230: IC5.31(OUTR11)
N$231: IC5.30(OUTG11)
N$232: IC5.19(OUTB6)
N$233: IC5.20(OUTR6)
N$234: IC5.21(OUTG6)
N$235: IC5.22(OUTB3)
N$236: IC5.23(OUTR3)
N$237: IC5.24(OUTG3)
N$238: IC5.25(OUTB7)
N$239: IC5.26(OUTR7)
N$240: IC5.27(OUTG7)
N$241: IC6.4(OUTB4)
N$242: IC6.5(OUTR4)
N$243: IC6.6(OUTG4)
N$244: IC6.7(OUTB0)
N$245: IC6.8(OUTR0)
N$246: IC6.9(OUTG0)
N$247: IC6.10(OUTB5)
N$248: IC6.11(OUTR5)
N$249: IC6.12(OUTG5)
N$250: IC6.13(OUTB1)
N$251: IC6.14(OUTR1)
N$252: IC6.15(OUTG1)
N$253: IC6.16(OUTB2)
N$254: IC6.17(OUTR2)
N$255: IC6.18(OUTG2)
N$256: IC6.53(OUTB8)
N$257: IC6.52(OUTR8)
N$258: IC6.51(OUTG8)
N$259: IC6.50(OUTB12)
N$260: IC6.49(OUTR12)
N$261: IC6.48(OUTG12)
N$262: IC6.47(OUTB9)
N$263: IC6.46(OUTR9)
N$264: IC6.45(OUTG9)
N$265: IC6.44(OUTB13)
N$266: IC6.43(OUTR13)
N$267: IC6.42(OUTG13)
N$268: IC6.41(OUTB14)
N$269: IC6.40(OUTR14)
N$270: IC6.39(OUTG14)
N$271: IC6.38(OUTB10)
N$272: IC6.37(OUTR10)
N$273: IC6.36(OUTG10)
N$274: IC6.35(OUTB15)
N$275: IC6.34(OUTR15)
N$276: IC6.33(OUTG15)
N$277: IC6.32(OUTB11)
N$278: IC6.31(OUTR11)
N$279: IC6.30(OUTG11)
N$280: IC6.19(OUTB6)
N$281: IC6.20(OUTR6)
N$282: IC6.21(OUTG6)
N$283: IC6.22(OUTB3)
N$284: IC6.23(OUTR3)
N$285: IC6.24(OUTG3)
N$286: IC6.25(OUTB7)
N$287: IC6.26(OUTR7)
N$288: IC6.27(OUTG7)
N$289: IC7.4(OUTB4)
N$290: IC7.5(OUTR4)
N$291: IC7.6(OUTG4)
N$292: IC7.7(OUTB0)
N$293: IC7.8(OUTR0)
N$294: IC7.9(OUTG0)
N$295: IC7.10(OUTB5)
N$296: IC7.11(OUTR5)
N$297: IC7.12(OUTG5)
N$298: IC7.13(OUTB1)
N$299: IC7.14(OUTR1)
N$300: IC7.15(OUTG1)
N$301: IC7.16(OUTB2)
N$302: IC7.17(OUTR2)
N$303: IC7.18(OUTG2)
N$304: IC7.53(OUTB8)
N$305: IC7.52(OUTR8)
N$306: IC7.51(OUTG8)
N$307: IC7.50(OUTB12)
N$308: IC7.49(OUTR12)
N$309: IC7.48(OUTG12)
N$310: IC7.47(OUTB9)
N$311: IC7.46(OUTR9)
N$312: IC7.45(OUTG9)
N$313: IC7.44(OUTB13)
N$314: IC7.43(OUTR13)
N$315: IC7.42(OUTG13)
N$316: IC7.41(OUTB14)
N$317: IC7.40(OUTR14)
N$318: IC7.39(OUTG14)
N$319: IC7.38(OUTB10)
N$320: IC7.37(OUTR10)
N$321: IC7.36(OUTG10)
N$322: IC7.35(OUTB15)
N$323: IC7.34(OUTR15)
N$324: IC7.33(OUTG15)
N$325: IC7.32(OUTB11)
N$326: IC7.31(OUTR11)
N$327: IC7.30(OUTG11)
N$328: IC7.19(OUTB6)
N$329: IC7.20(OUTR6)
N$330: IC7.21(OUTG6)
N$331: IC7.22(OUTB3)
N$332: IC7.23(OUTR3)
N$333: IC7.24(OUTG3)
N$334: IC7.25(OUTB7)
N$335: IC7.26(OUTR7)
N$336: IC7.27(OUTG7)
N$337: IC8.4(OUTB4)
N$338: IC8.5(OUTR4)
N$339: IC8.6(OUTG4)
N$340: IC8.7(OUTB0)
N$341: IC8.8(OUTR0)
N$342: IC8.9(OUTG0)
N$343: IC8.10(OUTB5)
N$344: IC8.11(OUTR5)
N$345: IC8.12(OUTG5)
N$346: IC8.13(OUTB1)
N$347: IC8.14(OUTR1)
N$348: IC8.15(OUTG1)
N$349: IC8.16(OUTB2)
N$350: IC8.17(OUTR2)
N$351: IC8.18(OUTG2)
N$352: IC8.53(OUTB8)
N$353: IC8.52(OUTR8)
N$354: IC8.51(OUTG8)
N$355: IC8.50(OUTB12)
N$356: IC8.49(OUTR12)
N$357: IC8.48(OUTG12)
N$358: IC8.47(OUTB9)
N$359: IC8.46(OUTR9)
N$360: IC8.45(OUTG9)
N$361: IC8.44(OUTB13)
N$362: IC8.43(OUTR13)
N$363: IC8.42(OUTG13)
N$364: IC8.41(OUTB14)
N$365: IC8.40(OUTR14)
N$366: IC8.39(OUTG14)
N$367: IC8.38(OUTB10)
N$368: IC8.37(OUTR10)
N$369: IC8.36(OUTG10)
N$370: IC8.35(OUTB15)
N$371: IC8.34(OUTR15)
N$372: IC8.33(OUTG15)
N$373: IC8.32(OUTB11)
N$374: IC8.31(OUTR11)
N$375: IC8.30(OUTG11)
N$376: IC8.19(OUTB6)
N$377: IC8.20(OUTR6)
N$378: IC8.21(OUTG6)
N$379: IC8.22(OUTB3)
N$380: IC8.23(OUTR3)
N$381: IC8.24(OUTG3)
N$382: IC8.25(OUTB7)
N$383: IC8.26(OUTR7)
N$384: IC8.27(OUTG7)
SCLK: IC1.2(SCLK) IC2.2(SCLK) IC3.2(SCLK) IC4.2(SCLK) IC5.2(SCLK) IC6.2(SCLK) IC7.2(SCLK) IC8.2(SCLK)
SIN_MCU: IC1.1(SIN) IC2.1(SIN) IC3.1(SIN) IC4.1(SIN) IC5.1(SIN) IC6.1(SIN) IC7.1(SIN) IC8.1(SIN)
SOUT1: IC1.28(SOUT) IC2.28(SOUT) IC3.28(SOUT) IC4.28(SOUT) IC5.28(SOUT) IC6.28(SOUT) IC7.28(SOUT) IC8.28(SOUT)

## Library data of the parts
IC1-IC8 = TLC5955DCAR:TLC5955DCAR: 48ch, 16bit PWM LED Driver with Dot-Correction, Brightness Control, Open/Short Detection Source: Datasheet <http://www.ti.com/lit/ds/symlink/tlc5955.pdf>; ARROW_PART_NUMBER: TLC5955DCAR; ARROW_PRICE-STOCK: https://www.arrow.com/en/products/tlc5955dcar/texas-instruments; DESCRIPTION: 48ch, 16bit PWM LED Driver with Dot-Correction, Brightness Control, Open/Short Detection; HEIGHT: 1.2mm; MANUFACTURER_NAME: Texas Instruments; MANUFACTURER_PART_NUMBER: TLC5955DCAR; MOUSER_PART_NUMBER: 595-TLC5955DCAR; MOUSER_PRICE-STOCK: https://www.mouser.co.uk/ProductDetail/Texas-Instruments/TLC5955DCAR?qs=%2Fd%252BFzHvH4c3zo%2FeGYG5n7g%3D%3D
LED1-LED120 = B38G3RGB:B38G3RGB: Standard LEDs - SMD Surface Mount LEDs Source: Datasheet <https://www.arrow.com/en/products/sml-lx0606igc-tr/lumex>; ARROW_PART_NUMBER: SML-LX0606IGC-TR; ARROW_PRICE-STOCK: https://www.arrow.com/en/products/sml-lx0606igc-tr/lumex; DESCRIPTION: Standard LEDs - SMD Surface Mount LEDs; HEIGHT: 0.7mm; MANUFACTURER_NAME: Lumex; MANUFACTURER_PART_NUMBER: SML-LX0606IGC-TR; MOUSER_PART_NUMBER: 696-SML-0606IGCTR; MOUSER_PRICE-STOCK: https://www.mouser.co.uk/ProductDetail/Lumex/SML-LX0606IGC-TR?qs=I1ILoAvtKy%252BVd7WFwiUkZQ%3D%3D